# Altium project PCB Version 0.1.PrjPcb
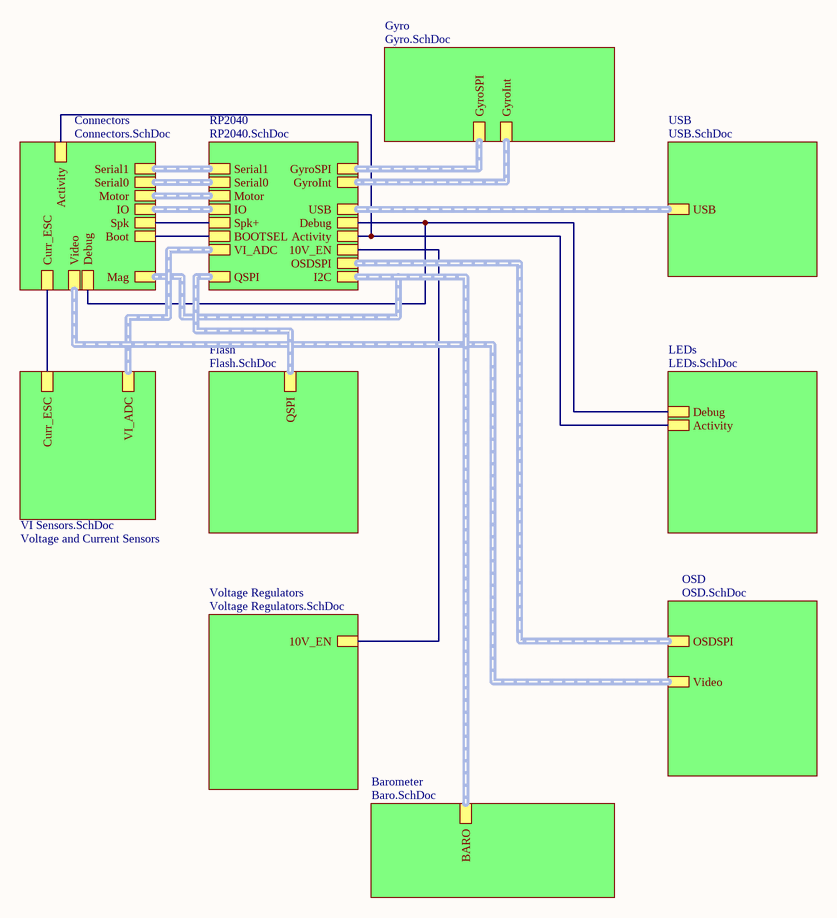
[diagram p0: Main.SchDoc]
5 sheets, 68 parts. Net scope: hierarchical (ports join the sheet entries above them; power ports are global).
Board file: PCB v0.1.PcbDoc
Sheets:
  Main.SchDoc
    Voltage Regulators = Voltage Regulators.SchDoc
    OSD = OSD.SchDoc
    Barometer = Baro.SchDoc
    Voltage and Current Sensors = VI Sensors.SchDoc

## Sheet Main.SchDoc
size A4; SheetNumber: 1; SheetTotal: 11

### Sub-sheets
Barometer = Baro.SchDoc: BARO
Connectors = Connectors.SchDoc (file not in this document): Serial1, Motor, Mag, Serial0, Curr_ESC, IO, Video, Spk, Debug, Activity, Boot
Flash = Flash.SchDoc (file not in this document): QSPI
Gyro = Gyro.SchDoc (file not in this document): GyroSPI, GyroInt
LEDs = LEDs.SchDoc (file not in this document): Debug, Activity
OSD = OSD.SchDoc: OSDSPI, Video
RP2040 = RP2040.SchDoc (file not in this document): QSPI, USB, Debug, Activity, I2C, OSDSPI, GyroSPI, GyroInt, Serial1, Motor, Serial0, VI_ADC, IO, Spk+, 10V_EN, BOOTSEL
USB = USB.SchDoc (file not in this document): USB
Voltage and Current Sensors = VI Sensors.SchDoc: Curr_ESC, VI_ADC
Voltage Regulators = Voltage Regulators.SchDoc: 10V_EN

### Nets
NetIC8_4: sheet Connectors/Curr_ESC, sheet Voltage and Current Sensors/Curr_ESC
NetR35_1: sheet RP2040/10V_EN, sheet Voltage Regulators/10V_EN
(unnamed): sheet RP2040/Debug, sheet LEDs/Debug, sheet Connectors/Debug
(unnamed): sheet RP2040/Activity, sheet LEDs/Activity, sheet Connectors/Activity
(unnamed): sheet RP2040/Spk+, sheet Connectors/Spk
(unnamed): sheet RP2040/BOOTSEL, sheet Connectors/Boot

### Buses and harness runs
harness sheet Barometer/BARO = sheet Connectors/Mag = sheet RP2040/I2C
harness sheet Connectors/IO = sheet RP2040/IO
harness sheet Connectors/Motor = sheet RP2040/Motor
harness sheet Connectors/Serial0 = sheet RP2040/Serial0
harness sheet Connectors/Serial1 = sheet RP2040/Serial1
harness sheet Connectors/Video = sheet OSD/Video
harness sheet Flash/QSPI = sheet RP2040/QSPI
harness sheet Gyro/GyroInt = sheet RP2040/GyroInt
harness sheet Gyro/GyroSPI = sheet RP2040/GyroSPI
harness sheet OSD/OSDSPI = sheet RP2040/OSDSPI
harness sheet RP2040/USB = sheet USB/USB
harness sheet RP2040/VI_ADC = sheet Voltage and Current Sensors/VI_ADC

## Sheet Voltage Regulators.SchDoc
size A4; SheetNumber: 4; SheetTotal: 11
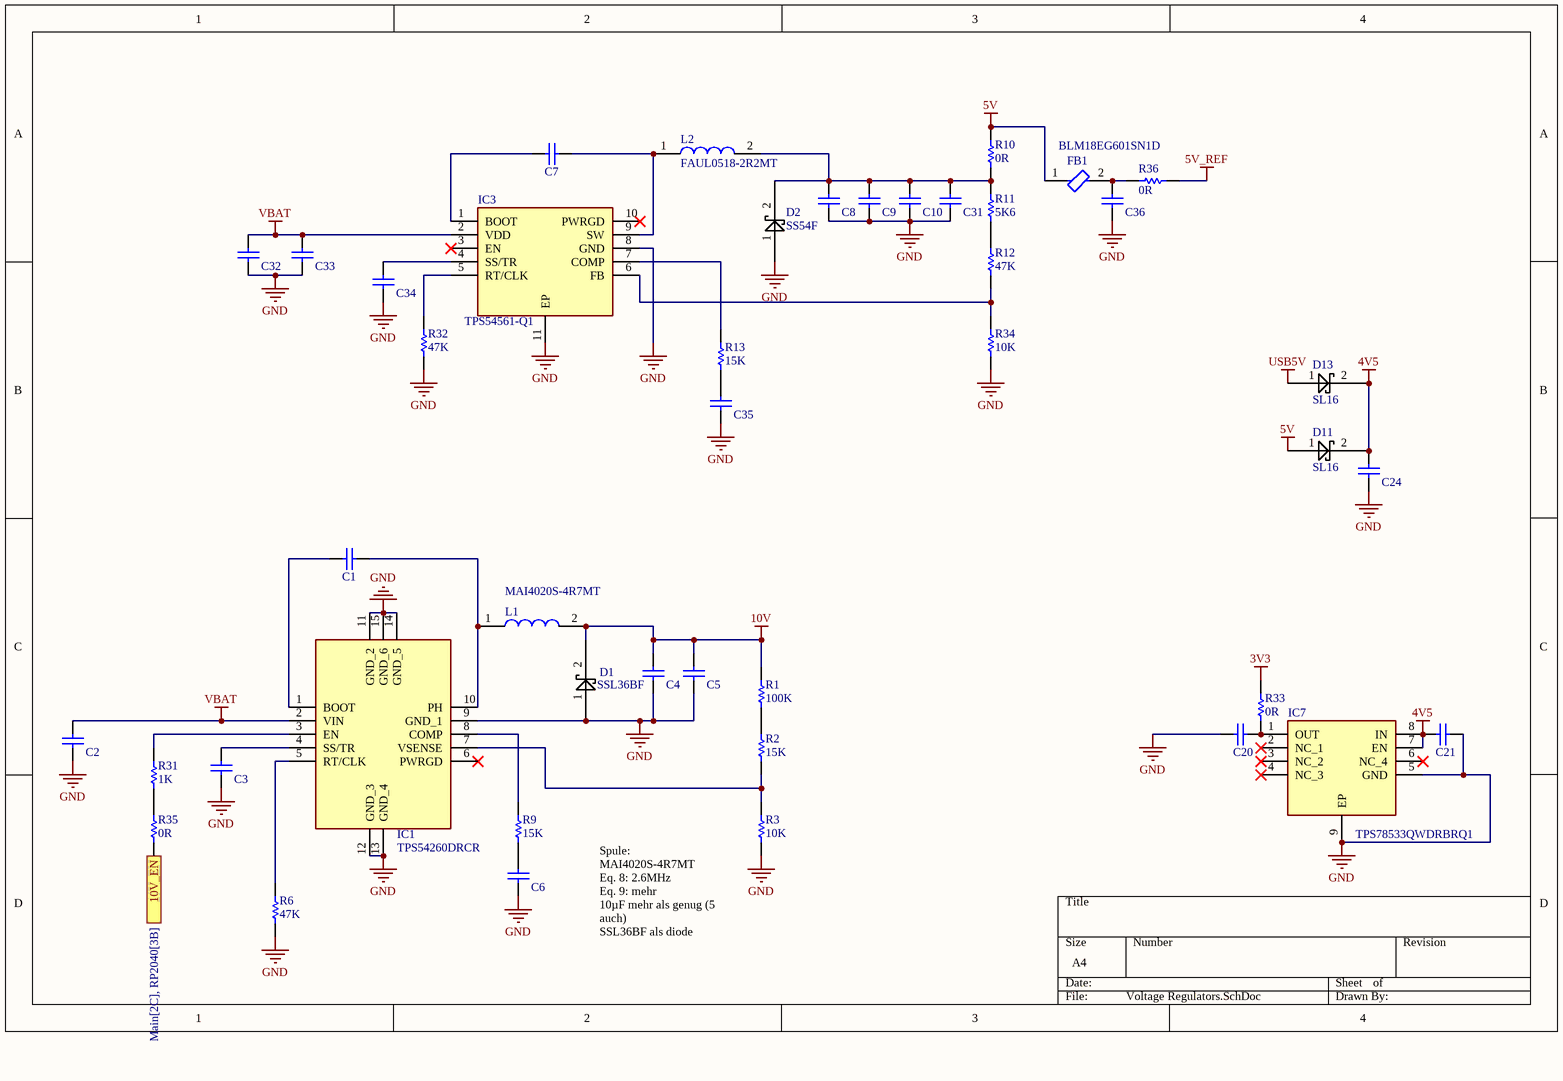
[diagram p1: Voltage Regulators.SchDoc]

### Parts
C1  100nF  [WCAP-CSGP_0603_L1.6W0.8H0.8_Reflow]  (value not drawn)
C2  3.3µF  [WCAP-CSGP_1206_L3.2W1.6H1.6]  (value not drawn)
C3  10nF  [WCAP-CSGP_0603_L1.6W0.8H0.8_Reflow]  (value not drawn)
C4  4.7µF  [WCAP-CSGP_0805_L2W1.25H1.25]  (value not drawn)
C5  4.7µF  [WCAP-CSGP_0805_L2W1.25H1.25]  (value not drawn)
C6  2.5pF  [WCAP-CSGP_0603_L1.6W0.8H0.8_Reflow]  (value not drawn)
C7  100nF  [WCAP-CSGP_0603_L1.6W0.8H0.8_Reflow]  (value not drawn)
C8  4.7µF  [WCAP-CSGP_0805_L2W1.25H1.25]  (value not drawn)
C9  4.7µF  [WCAP-CSGP_0805_L2W1.25H1.25]  (value not drawn)
C10  4.7µF  [WCAP-CSGP_0805_L2W1.25H1.25]  (value not drawn)
C20  1µF  [WCAP-CSGP_0603_L1.6W0.8H0.8_Reflow]  (value not drawn)
C21  1µF  [WCAP-CSGP_0603_L1.6W0.8H0.8_Reflow]  (value not drawn)
C24  1µF  [WCAP-CSGP_0603_L1.6W0.8H0.8_Reflow]  (value not drawn)
C31  4.7µF  [WCAP-CSGP_0805_L2W1.25H1.25]  (value not drawn)
C32  2.2µF  [WCAP-CSGP_0805_L2W1.25H1.25]  (value not drawn)
C33  2.2µF  [WCAP-CSGP_0805_L2W1.25H1.25]  (value not drawn)
C34  10nF  [WCAP-CSGP_0603_L1.6W0.8H0.8_Reflow]  (value not drawn)
C35  1nF  [WCAP-CSGP_0603_L1.6W0.8H0.8_Reflow]  (value not drawn)
C36  1µF  [WCAP-CSGP_0603_L1.6W0.8H0.8_Reflow]  (value not drawn)
D1  SSL36BF  [SSL36BF]
D2  SS54F  [SS54F]
D11  SL16  [SL16]
D13  SL16  [SL16]
FB1  BLM18EG601SN1D  [FP-BLM18-0_15-t0_8-MFG]
IC1  TPS54260DRCR  [TPS54040ADRCT]
IC3  TPS54561-Q1  [SON80P400X400X80-11N]
IC7  TPS78533QWDRBRQ1  [SON65P300X300X100-9N-D]
L1  MAI4020S-4R7MT  [MAI4020S-4R7MT]
L2  FAUL0518-2R2MT  [FAUL0518-2R2MT]
R1  100K  [RESC0603(1608)_N]
R2  15K  [RESC0603(1608)_N]
R3  10K  [RESC0603(1608)_N]
R6  47K  [RESC0603(1608)_N]
R9  15K  [RESC0603(1608)_N]
R10  0R  [RESC0603(1608)_N]
R11  5K6  [RESC0603(1608)_N]
R12  47K  [RESC0603(1608)_N]
R13  15K  [RESC0603(1608)_N]
R31  1K  [RESC0603(1608)_N]
R32  47K  [RESC0603(1608)_N]
R33  0R  [RESC0603(1608)_N]
R34  10K  [RESC0603(1608)_N]
R35  0R  [RESC0603(1608)_N]
R36  0R  [RESC0603(1608)_N]

### Ports
10V_EN (see Main[2C], RP2040[3B])

### Nets
3V3: R33.2
4V5: C21.1 C24.2 D11.2 D13.2 IC7.7(EN) IC7.8(IN)
5V: D11.1 FB1.1 R10.2
5V_REF: R36.2
10V: C4.2 C5.2 D1.2 L1.2 R1.2
GND: C2.1 C3.1 C4.1 C5.1 C6.1 C8.1 C9.1 C10.1 C20.1 C21.2 C24.1 C31.1 C32.1 C33.1 C34.1 C35.1 C36.1 D1.1 D2.1 IC1.9(GND_1) IC1.11(GND_2) IC1.12(GND_3) IC1.13(GND_4) IC1.14(GND_5) IC1.15(GND_6) IC3.8(GND) IC3.11(EP) IC7.5(GND) IC7.9(EP) R3.1 R6.1 R32.1 R34.1
USB5V: D13.1
VBAT: C2.2 C32.2 C33.2 IC1.2(VIN) IC3.2(VDD)
NetC1_1: C1.1 IC1.1(BOOT)
NetC1_2: C1.2 IC1.10(PH) L1.1
NetC3_2: C3.2 IC1.4(SS/TR)
NetC6_2: C6.2 R9.1
NetC7_1: C7.1 IC3.1(BOOT)
NetC7_2: C7.2 IC3.9(SW) L2.1
NetC8_2: C8.2 C9.2 C10.2 C31.2 D2.2 L2.2 R10.1 R11.2
NetC20_2: C20.2 IC7.1(OUT) R33.1
NetC34_2: C34.2 IC3.4(SS/TR)
NetC35_2: C35.2 R13.1
NetC36_2: C36.2 FB1.2 R36.1
NetIC1_3: IC1.3(EN) R31.2
NetIC1_5: IC1.5(RT/CLK) R6.2
NetIC1_7: IC1.7(VSENSE) R2.1 R3.2
NetIC1_8: IC1.8(COMP) R9.2
NetIC3_5: IC3.5(RT/CLK) R32.2
NetIC3_6: IC3.6(FB) R12.1 R34.2
NetIC3_7: IC3.7(COMP) R13.2
NetR1_1: R1.1 R2.2
NetR11_1: R11.1 R12.2
NetR31_1: R31.1 R35.2
NetR35_1: R35.1 ; port 10V_EN

Not connected (* = marked no-connect by the designer): IC1 6(PWRGD)*; IC3 3(EN)* 10(PWRGD)*; IC7 2(NC_1)* 3(NC_2)* 4(NC_3)* 6(NC_4)*

### Notes on the sheet
- (near R3) Spule: MAI4020S-4R7MT
  Eq. 8: 2.6MHz
  Eq. 9: mehr
  10µF mehr als genug (5 auch)
  SSL36BF als diode

### Library data of the parts
C1 C7 = 885012206046: WCAP-CSGP Multilayer Ceramic Chip Capacitor, General Purpose, size 0603, X7R, 100nF, 16VDC; Manufacturer: Wurth Elektronik; Case/Size Code: 0603; Capacitance Tolerance: +/-10%; Dissipation Factor: 3.5%; Insulation Resistance: 5GΩ; Rated Voltage (DC): 16V; Technical Reference: X7R0603104K016DFCT10000; ComponentLink1Description: Website Link; ComponentLink1URL: https://www.we-online.com/redexpert/article/885012206046?ad; ComponentLink2Description: Datasheet Link; ComponentLink2URL: https://www.we-online.com/redexpert/spec/885012206046?ad; Manufacturer Part Number: 885012206046; Category: Multilayer Ceramic Chip Capacitors; Match Code: WCAP-CSGP; Mount: Surface Mount; Operating Temperature Max: 125°C; Operating Temperature Min: -55°C; Packaging: Tape and Reel; Length: 1.6mm; Width: 0.8mm; Height: 0.8mm; Capacitance: 100nF; Ceramic Type: X7R
C2 = 885012208124: TDK C3216X7S2A335KT000N / 3.3µF MLCC 1206 100V X7S; Manufacturer: Wurth Elektronik; Match Code: WCAP-CSGP; Case/Size Code: 1206; Capacitance: 2.2µF; Capacitance Tolerance: +/-10%; Ceramic Type: X7R; Dissipation Factor: 5%; Insulation Resistance: 0.05GΩ; Technical Reference: X7R1206225K100DFCT10000; ComponentLink1Description: Website Link; ComponentLink1URL: https://www.we-online.com/redexpert/article/885012208124?ad; ComponentLink2Description: Datasheet Link; ComponentLink2URL: https://www.we-online.com/redexpert/spec/885012208124?ad; Manufacturer Part Number: 885012208124; Category: Multilayer Ceramic Chip Capacitors; Mount: Surface Mount; Operating Temperature Max: 125°C; Operating Temperature Min: -55°C; Packaging: Tape and Reel; Length: 3.2mm; Width: 1.6mm; Height: 1.6mm; Rated Voltage (DC): 100V
C3 C34 = 885012206040: WCAP-CSGP Multilayer Ceramic Chip Capacitor, General Purpose, size 0603, X7R, 10nF, 16VDC; Manufacturer: Wurth Elektronik; Case/Size Code: 0603; Capacitance Tolerance: +/-10%; Dissipation Factor: 3.5%; Insulation Resistance: 10GΩ; Rated Voltage (DC): 16V; Technical Reference: X7R0603103K016DFCT10000; ComponentLink1Description: Website Link; ComponentLink1URL: https://www.we-online.com/redexpert/article/885012206040?ad; ComponentLink2Description: Datasheet Link; ComponentLink2URL: https://www.we-online.com/redexpert/spec/885012206040?ad; Manufacturer Part Number: 885012206040; Category: Multilayer Ceramic Chip Capacitors; Match Code: WCAP-CSGP; Mount: Surface Mount; Operating Temperature Max: 125°C; Operating Temperature Min: -55°C; Packaging: Tape and Reel; Length: 1.6mm; Width: 0.8mm; Height: 0.8mm; Capacitance: 10nF; Ceramic Type: X7R
C4 C5 C8-C10 C31 = 885012107013: CL21A475KAQNNNG; Manufacturer: Wurth Elektronik; Match Code: WCAP-CSGP; Case/Size Code: 0805; Capacitance Tolerance: +/-20%; Ceramic Type: X5R; Dissipation Factor: 10%; Insulation Resistance: 0.02GΩ; Rated Voltage (DC): 16V; Technical Reference: X5R0805475M016DFCT10000; ComponentLink1Description: Website Link; ComponentLink1URL: https://www.we-online.com/redexpert/article/885012107013?ad; ComponentLink2Description: Datasheet Link; ComponentLink2URL: https://www.we-online.com/redexpert/spec/885012107013?ad; Manufacturer Part Number: 885012107013; Category: Multilayer Ceramic Chip Capacitors; Mount: Surface Mount; Operating Temperature Max: 85°C; Operating Temperature Min: -55°C; Packaging: Tape and Reel; Length: 2mm; Width: 1.25mm; Height: 1.25mm; Capacitance: 4.7µF
C6 C35 = 885012006030: TCC0603COG2R5C500CT; Manufacturer: Wurth Elektronik; Match Code: WCAP-CSGP; Case/Size Code: 0603; Capacitance: 4.7pF; Capacitance Tolerance: +/-0.5pF; Ceramic Type: NP0; Insulation Resistance: 10GΩ; Q Factor: 494; Rated Voltage (DC): 25V; Technical Reference: NP006034R7D025DFCT10000; ComponentLink1Description: Website Link; ComponentLink1URL: https://www.we-online.com/redexpert/article/885012006030?ad; ComponentLink2Description: Datasheet Link; ComponentLink2URL: https://www.we-online.com/redexpert/spec/885012006030?ad; Manufacturer Part Number: 885012006030; Category: Multilayer Ceramic Chip Capacitors; Mount: Surface Mount; Operating Temperature Max: 125°C; Operating Temperature Min: -55°C; Packaging: Tape and Reel; Length: 1.6mm; Width: 0.8mm; Height: 0.8mm
C20 C21 C36 = 885012206026: WCAP-CSGP Multilayer Ceramic Chip Capacitor, General Purpose, size 0603, X7R, 1µF, 10VDC; Manufacturer: Wurth Elektronik; Case/Size Code: 0603; Capacitance Tolerance: +/-10%; Dissipation Factor: 10%; Insulation Resistance: 0.1GΩ; Rated Voltage (DC): 10V; Technical Reference: X7R0603105K010DFCT10000; ComponentLink1Description: Website Link; ComponentLink1URL: https://www.we-online.com/redexpert/article/885012206026?ad; ComponentLink2Description: Datasheet Link; ComponentLink2URL: https://www.we-online.com/redexpert/spec/885012206026?ad; Manufacturer Part Number: 885012206026; Category: Multilayer Ceramic Chip Capacitors; Match Code: WCAP-CSGP; Mount: Surface Mount; Operating Temperature Max: 125°C; Operating Temperature Min: -55°C; Packaging: Tape and Reel; Length: 1.6mm; Width: 0.8mm; Height: 0.8mm; Capacitance: 1µF; Ceramic Type: X7R
C24 = 885012106017: WCAP-CSGP Multilayer Ceramic Chip Capacitor, General Purpose, size 0603, X5R, 1µF, 16VDC; Manufacturer: Wurth Elektronik; Case/Size Code: 0603; Capacitance Tolerance: +/-20%; Dissipation Factor: 10%; Insulation Resistance: 0.1GΩ; Rated Voltage (DC): 16V; Technical Reference: X5R0603105M016DFCT10000; ComponentLink1Description: Website Link; ComponentLink1URL: https://www.we-online.com/redexpert/article/885012106017?ad; ComponentLink2Description: Datasheet Link; ComponentLink2URL: https://www.we-online.com/redexpert/spec/885012106017?ad; Manufacturer Part Number: 885012106017; Category: Multilayer Ceramic Chip Capacitors; Match Code: WCAP-CSGP; Mount: Surface Mount; Operating Temperature Max: 85°C; Operating Temperature Min: -55°C; Packaging: Tape and Reel; Length: 1.6mm; Width: 0.8mm; Height: 0.8mm; Capacitance: 1µF; Ceramic Type: X5R
C32 C33 = 885012107013: CL21B225KBYNNNE; Manufacturer: Wurth Elektronik; Match Code: WCAP-CSGP; Case/Size Code: 0805; Capacitance: 4.7µF; Capacitance Tolerance: +/-20%; Ceramic Type: X5R; Dissipation Factor: 10%; Insulation Resistance: 0.02GΩ; Rated Voltage (DC): 16V; Technical Reference: X5R0805475M016DFCT10000; ComponentLink1Description: Website Link; ComponentLink1URL: https://www.we-online.com/redexpert/article/885012107013?ad; ComponentLink2Description: Datasheet Link; ComponentLink2URL: https://www.we-online.com/redexpert/spec/885012107013?ad; Manufacturer Part Number: 885012107013; Category: Multilayer Ceramic Chip Capacitors; Mount: Surface Mount; Operating Temperature Max: 85°C; Operating Temperature Min: -55°C; Packaging: Tape and Reel; Length: 2mm; Width: 1.25mm; Height: 1.25mm
FB1 = CMP-0686-00354-3: Chip Ferrite Bead, 0603, 600Ω @ 100MHz, 0.35Ω, 25%, 500mA; Manufacturer Series: BLM18E; Number of Lines: 1; DC Resistance (DCR): 350mR; Impedance: 600R; Material: Steel; Shielding: Unshielded; Package Quantity: 1; Case/Package: 0603; Length: 1.6mm; Packaging: Tape and Reel; Resistance: 350mR; REACH SVHC: No SVHC; Military Standard: Not; Contact Plating: Tin; Termination: SMD/SMT; Number of Circuits: 1; Width: 0.8mm; Test Frequency: 100MHz; DC Current: 500mA; Case Code (Metric): 1608; Max DC Current: 500mA; Max Operating Temperature: 125°C; Current Rating: 500mA; Series: BLM18E; Tolerance: 25%; Min Operating Temperature: -55°C; Frequency: 100MHz; Lead Free: Lead Free; Terminal Finish: Tin; Number of Pins: 2; Max Current Rating: 500mA; Radiation Hardening: No; Case Code (Imperial): 0603; Number of Functions: 1; Depth: 0.8mm; DC Resistance-Max: 350mR; Height: 0.8mm; Core Material: Ferrite; RoHS Compliant: Yes
IC1 = TPS54260DRCR: Integrated Circuit; Manufacturer_Name: Texas Instruments; Datasheet Link: http://www.ti.com/lit/gpn/TPS54040A; Height: 1mm; Manufacturer_Part_Number: TPS54260DRCR; Mouser Part Number: 595-TPS54260DRCR; Mouser Price/Stock: https://www.mouser.co.uk/ProductDetail/Texas-Instruments/TPS54260DRCR?qs=O1HRStiETChM7xK%2FSiuP6w%3D%3D; Arrow Part Number: TPS54260DRCR; Arrow Price/Stock: https://www.arrow.com/en/products/tps54260drcr/texas-instruments?region=nac
IC3 = TPS54561-Q1: Integrated Circuit; Manufacturer_Name: Texas Instruments; Datasheet Link: http://www.ti.com/lit/gpn/tps54561-q1; Height: 0.8mm; Manufacturer_Part_Number: TPS54561-Q1
IC7 = TPS78533QWDRBRQ1: Integrated Circuit; Manufacturer_Name: Texas Instruments; Datasheet Link: https://www.arrow.com/en/products/tps78533qwdrbrq1/texas-instruments?region=nac; Height: 1mm; Manufacturer_Part_Number: TPS78533QWDRBRQ1; Mouser Part Number: 595-TPS78533QWDRBRQ1; Mouser Price/Stock: https://www.mouser.co.uk/ProductDetail/Texas-Instruments/TPS78533QWDRBRQ1?qs=iLbezkQI%252BsiNbdqh2Ko9GQ%3D%3D; Arrow Part Number: TPS78533QWDRBRQ1; Arrow Price/Stock: https://www.arrow.com/en/products/tps78533qwdrbrq1/texas-instruments?region=nac
R1 = Res 100K: Chipwiderstand, SMD, Baureihe MC, 1%; Manufacturer: Multicomp; PackageReference: 0603; Value: 100K; OC_FARNELL: 9330402
R2 R9 R12 R13 = Res 12K: Chipwiderstand, SMD, Baureihe MC, 1%; Manufacturer: Multicomp; Value: 12K; PackageReference: 0603; OC_FARNELL: 9330518
R3 R34 = Res 10K: Chipwiderstand, SMD, Baureihe MC, 1%; Manufacturer: Multicomp; PackageReference: 0603; Value: 10K; OC_FARNELL: 9330399
R6 R32 = Res 47R: Chipwiderstand, SMD, Baureihe MC, 1%; Manufacturer: Multicomp; Value: 47R; PackageReference: 0603; OC_FARNELL: 1576259
R10 R33 R35 R36 = Res 0R: Chipwiderstand, SMD, Baureihe MC, 1%; Manufacturer: Multicomp; PackageReference: 0603; Value: 0R; OC_FARNELL: 9331662
R11 = Res 100K: Chipwiderstand, SMD, Baureihe MC, 1%; Manufacturer: Multicomp; Value: 100K; PackageReference: 0603; OC_FARNELL: 9330402
R31 = Res 1K: Chipwiderstand, SMD, Baureihe MC, 1%; Manufacturer: Multicomp; PackageReference: 0603; Value: 1K; OC_FARNELL: 9330380

## Sheet OSD.SchDoc
size A4; SheetNumber: 7; SheetTotal: 11
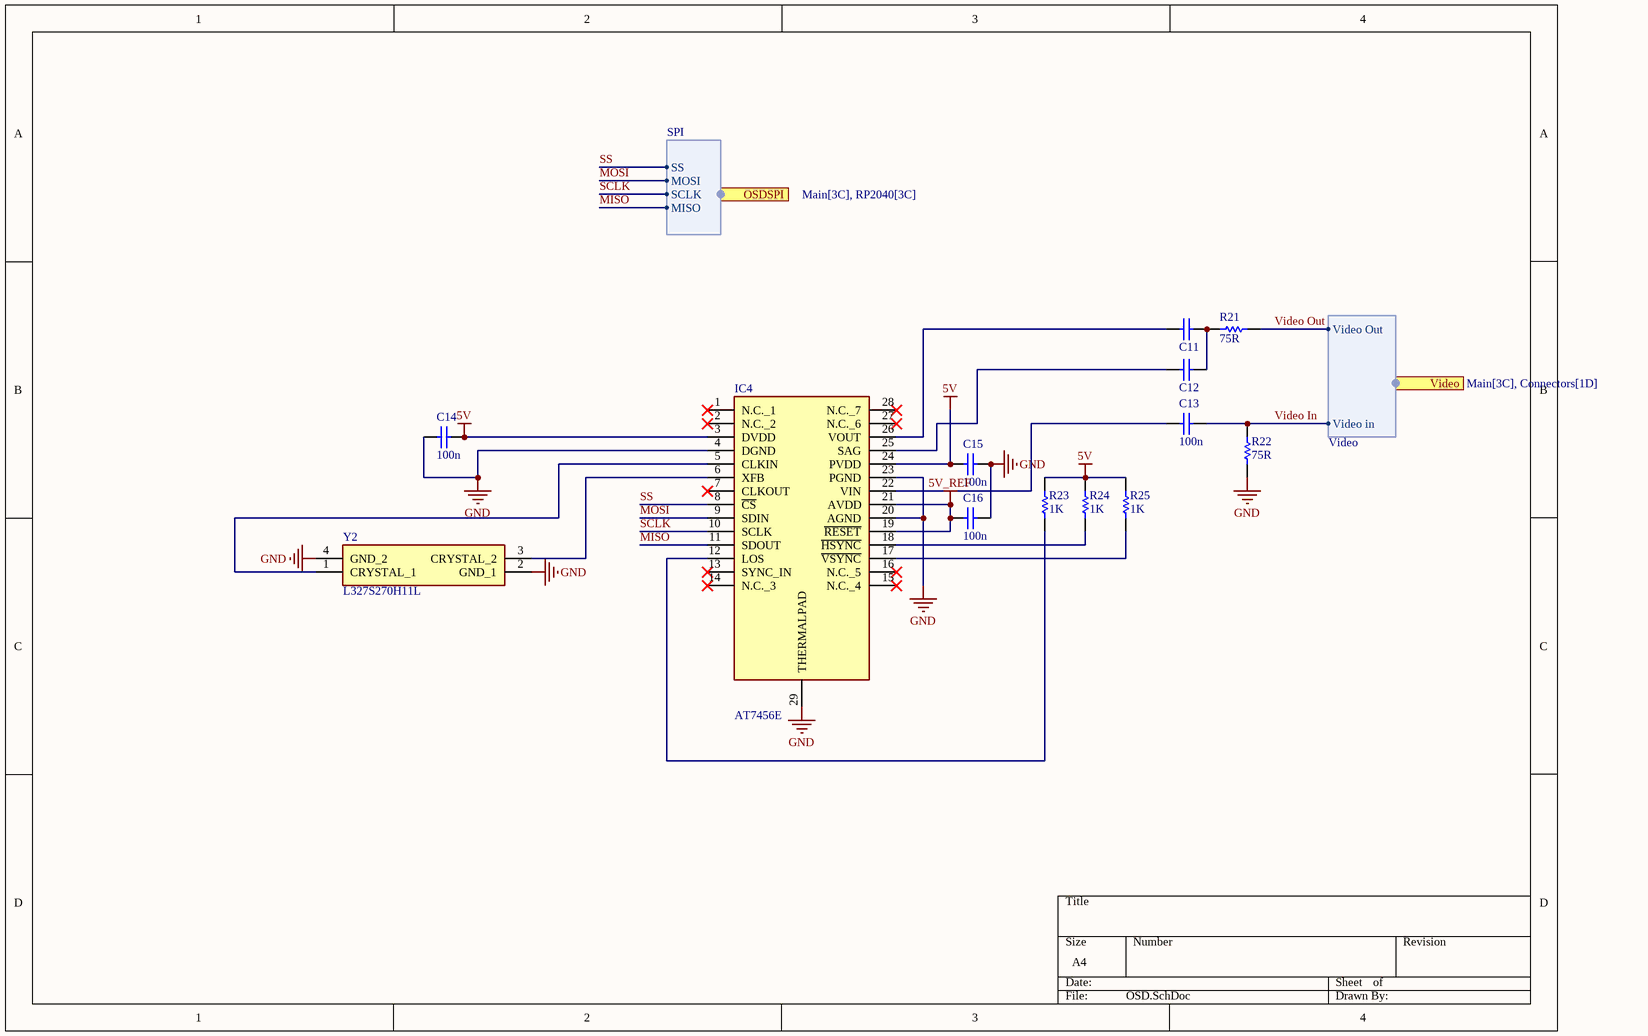
[diagram p2: OSD.SchDoc]

### Parts
C11  10µF  [WCAP-CSGP_0603_L1.6W0.8H0.8_Reflow]  (value not drawn)
C12  10µF  [WCAP-CSGP_0603_L1.6W0.8H0.8_Reflow]  (value not drawn)
C13  100n  [CAPC0603(1608)55_N]
C14  100n  [CAPC0603(1608)55_N]
C15  100n  [CAPC0603(1608)55_N]
C16  100n  [CAPC0603(1608)55_N]
IC4  AT7456E  [SOP65P640X120-29N]
R21  75R  [RESC0603(1608)_N]
R22  75R  [RESC0603(1608)_N]
R23  1K  [RESC0603(1608)_N]
R24  1K  [RESC0603(1608)_N]
R25  1K  [RESC0603(1608)_N]
Y2  L327S270H11L  [SMD3225_4P12288MHZ12PF10PPM4085]

### Ports
OSDSPI (harness SPI, see Main[3C], RP2040[3C]), Video (harness Video, see Main[3C], Connectors[1D])

### Harnesses
SPI: SS, MOSI, SCLK, MISO
Video: Video Out, Video in

### Nets
5V: C14.2 C15.1 IC4.3(DVDD) IC4.24(PVDD) R23.2 R24.2 R25.2
5V_REF: C16.1 IC4.19(~{RESET}) IC4.21(AVDD)
GND: C14.1 C15.2 C16.2 IC4.4(DGND) IC4.20(AGND) IC4.23(PGND) IC4.29(THERMALPAD) R22.1 Y2.2(GND_1) Y2.4(GND_2)
MISO: IC4.11(SDOUT) ; port OSDSPI.MISO
MOSI: IC4.9(SDIN) ; port OSDSPI.MOSI
SCLK: IC4.10(SCLK) ; port OSDSPI.SCLK
SS: IC4.8(~{CS}) ; port OSDSPI.SS
Video In: C13.2 R22.2 ; port Video.Video in
Video Out: R21.1 ; port Video.Video Out
NetC11_1: C11.1 IC4.26(VOUT)
NetC11_2: C11.2 C12.2 R21.2
NetC12_1: C12.1 IC4.25(SAG)
NetC13_1: C13.1 IC4.22(VIN)
NetIC4_5: IC4.5(CLKIN) Y2.1(CRYSTAL_1)
NetIC4_6: IC4.6(XFB) Y2.3(CRYSTAL_2)
NetIC4_12: IC4.12(LOS) R23.1
NetIC4_17: IC4.17(~{VSYNC}) R25.1
NetIC4_18: IC4.18(~{HSYNC}) R24.1

Not connected (* = marked no-connect by the designer): IC4 1(N.C._1)* 2(N.C._2)* 7(CLKOUT)* 13(SYNC_IN)* 14(N.C._3)* 15(N.C._4)* 16(N.C._5)* 27(N.C._6)* 28(N.C._7)*

### Library data of the parts
C11 C12 = 885012106031: WCAP-CSGP Multilayer Ceramic Chip Capacitor, General Purpose, size 0603, X5R, 10µF, 25VDC; Manufacturer: Wurth Elektronik; Case/Size Code: 0603; Capacitance Tolerance: +/20%; Dissipation Factor: 20%; Insulation Resistance: 0.01GΩ; Rated Voltage (DC): 25V; Technical Reference: X5R0603106M025DFCT10000; ComponentLink1Description: Website Link; ComponentLink1URL: https://www.we-online.com/redexpert/article/885012106031?ad; ComponentLink2Description: Datasheet Link; ComponentLink2URL: https://www.we-online.com/redexpert/spec/885012106031?ad; Manufacturer Part Number: 885012106031; Category: Multilayer Ceramic Chip Capacitors; Match Code: WCAP-CSGP; Mount: Surface Mount; Operating Temperature Max: 85°C; Operating Temperature Min: -55°C; Packaging: Tape and Reel; Length: 1.6mm; Width: 0.8mm; Height: 0.8mm; Capacitance: 10µF; Ceramic Type: X5R
C13-C16 = Cap 100n: Keramikvielschichtkondensator, SMD, Baureihe MC, ± 20%; Manufacturer: Multicomp; OC_FARNELL: 1759038; Value: 100n; PackageReference: 0603
IC4 = AT7456E: Integrated Circuit; Manufacturer_Name: ICOF; Datasheet Link: https://datasheet.lcsc.com/szlcsc/ZHONGKEWEI-AT7456E_C82351.pdf; Height: 1.2mm; Manufacturer_Part_Number: AT7456E
R21 R22 = Res 750R: Chipwiderstand, SMD, Baureihe MC, 1%; Manufacturer: Multicomp; Value: 750R; PackageReference: 0603; OC_FARNELL: 9331506
R23-R25 = Res 1K: as R31 on sheet Voltage Regulators; PackageReference: 0603; Value: 1K; OC_FARNELL: 9330380
Y2 = SMD-3225_4P_12.288MHZ_12PF_10PPM_-40~+85: Crystal or Oscillator; Manufacturer_Name: TAE(Zhejiang Abel Elec); Manufacturer_Part_Number: SMD-3225_4P 12.288MHZ 12PF 10PPM -40~+85¡æ; Datasheet Link: https://datasheet.lcsc.com/szlcsc/1901241506_Zhejiang-Abel-Elec-SMD-3225-4P-12-288MHZ-12PF-10PPM-40-85_C362472.pdf; Height: 0.8mm

## Sheet Baro.SchDoc
size A4; SheetNumber: 8; SheetTotal: 11
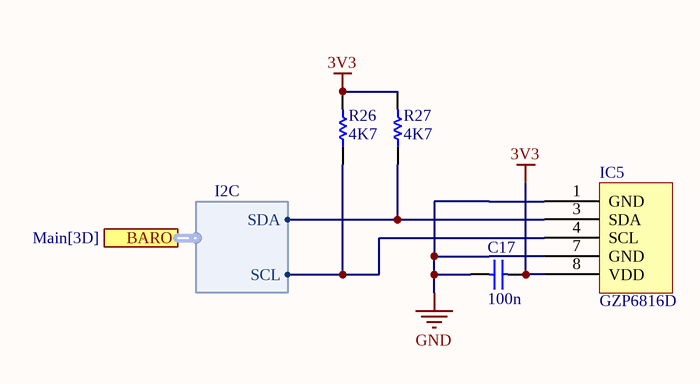
[diagram p3: Baro.SchDoc]

### Parts
C17  100n  [CAPC0603(1608)55_N]
IC5  GZP6816D  [GZP6816D]
R26  4K7  [RESC0603(1608)_N]
R27  4K7  [RESC0603(1608)_N]

### Ports
BARO (harness I2C, see Main[3D])

### Harnesses
I2C: SDA, SCL

### Nets
3V3: C17.1 IC5.8(VDD) R26.2 R27.2
GND: C17.2 IC5.1(GND) IC5.7(GND)
NetIC5_3: IC5.3(SDA) R27.1 ; port BARO.SDA
NetIC5_4: IC5.4(SCL) R26.1 ; port BARO.SCL

### Library data of the parts
C17 = Cap 100n: as C13 on sheet OSD; OC_FARNELL: 1759038; Value: 100n; PackageReference: 0603
R26 R27 = Res 4k7: Chipwiderstand, SMD, Baureihe MC, 5%; Manufacturer: Multicomp; PackageReference: 0603; Value: 4K7; OC_FARNELL: 9332154

## Sheet VI Sensors.SchDoc
size A4; SheetNumber: 11; SheetTotal: 11
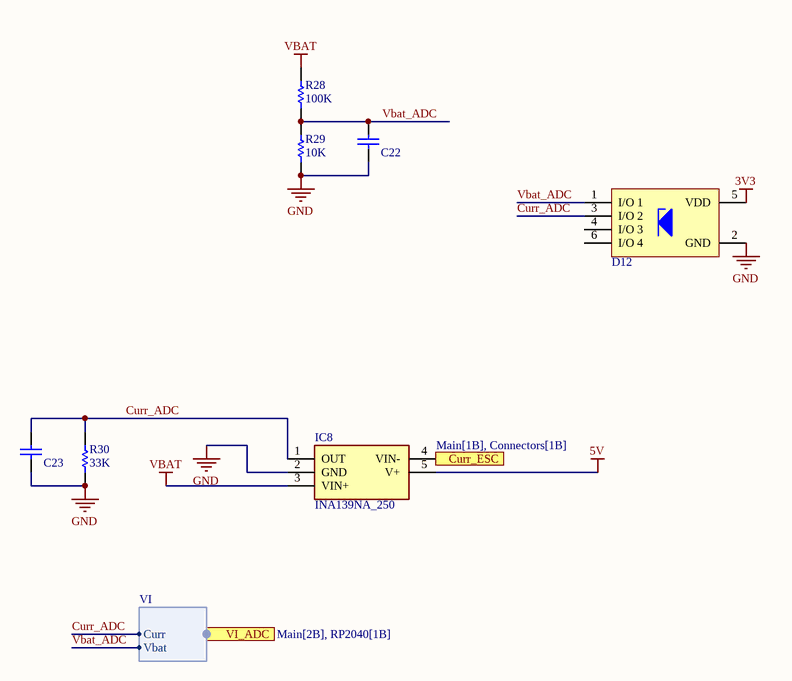
[diagram p4: VI Sensors.SchDoc]

### Parts
C22  1µF  [WCAP-CSGP_0603_L1.6W0.8H0.8_Reflow]  (value not drawn)
C23  1µF  [WCAP-CSGP_0603_L1.6W0.8H0.8_Reflow]  (value not drawn)
D12  3.3V  [WE-TVS_SOT23-6L]  (value not drawn)
IC8  INA139NA_250  [SOT95P280X145-5N]
R28  100K  [RESC0603(1608)_N]
R29  10K  [RESC0603(1608)_N]
R30  33K  [RESC0603(1608)_N]

### Ports
Curr_ESC (see Main[1B], Connectors[1B]), VI_ADC (harness VI, see Main[2B], RP2040[1B])

### Harnesses
VI: Curr, Vbat

### Nets
3V3: D12.5(VDD)
5V: IC8.5(V+)
GND: C22.1 C23.1 D12.2(GND) IC8.2(GND) R29.1 R30.1
VBAT: IC8.3(VIN+) R28.2
Curr_ADC: C23.2 D12.3(I/O_2) IC8.1(OUT) R30.2 ; port VI_ADC.Curr
Vbat_ADC: C22.2 D12.1(I/O_1) R28.1 R29.2 ; port VI_ADC.Vbat
NetIC8_4: IC8.4(VIN-) ; port Curr_ESC

Not connected (* = marked no-connect by the designer): D12 4(I/O_3) 6(I/O_4)

### Library data of the parts
C22 C23 = 885012106017: as C24 on sheet Voltage Regulators; ComponentLink1Description: Website Link; ComponentLink1URL: https://www.we-online.com/redexpert/article/885012106017?ad; ComponentLink2Description: Datasheet Link; ComponentLink2URL: https://www.we-online.com/redexpert/spec/885012106017?ad; Manufacturer Part Number: 885012106017; Category: Multilayer Ceramic Chip Capacitors; Match Code: WCAP-CSGP; Mount: Surface Mount; Operating Temperature Max: 85°C; Operating Temperature Min: -55°C; Packaging: Tape and Reel; Length: 1.6mm; Width: 0.8mm; Height: 0.8mm; Capacitance: 1µF; Ceramic Type: X5R
D12 = 824015043: Shenzhen JingYang TT0514VL; Manufacturer: Wurth Elektronik; Match Code: WE-TVS; Case/Size Code: SOT23-6L; Channel ESD Clamping Voltage: 7.5V; Channel Input Capacitance: 2pF; Channel Reverse Leakage Current: 1µA; ESD Air Discharge Capability: 30kV; Number of Channels: 4+1; Polarity: Unidirectional; (Reverse) Breakdown Voltage: 4.5V; (Reverse) Peak Pulse Current: 30A; ComponentLink1Description: Website Link; ComponentLink1URL: https://www.we-online.com/redexpert/article/824015043?ad; ComponentLink2Description: Datasheet Link; ComponentLink2URL: https://www.we-online.com/redexpert/spec/824015043?ad; Manufacturer Part Number: 824015043; Category: ESD Protection; Mount: Surface Mount; Operating Temperature Max: 125°C; Operating Temperature Min: -55°C; Packaging: Tape and Reel; Length: 2.9mm; Width: 2.8mm; Height: 1.45mm; Channel Operating Voltage: 3.3V; ESD Contact Discharge Capability: 30kV
IC8 = INA139NA_250: Integrated Circuit; Manufacturer_Name: Texas Instruments; Manufacturer_Part_Number: INA139NA/250; Datasheet Link: http://www.ti.com/lit/ds/symlink/ina139.pdf; Height: 1.45mm; Mouser Part Number: 595-INA139NA/250; Mouser Price/Stock: https://www.mouser.co.uk/ProductDetail/Texas-Instruments/INA139NA-250?qs=VBduBm9rCJQSYOixXF05Zw%3D%3D; Arrow Part Number: INA139NA/250; Arrow Price/Stock: https://www.arrow.com/en/products/ina139na250/texas-instruments?region=nac
R28 = Res 100K: as R1 on sheet Voltage Regulators; PackageReference: 0603; Value: 100K; OC_FARNELL: 9330402
R29 = Res 10K: as R3 on sheet Voltage Regulators; PackageReference: 0603; Value: 10K; OC_FARNELL: 9330399
R30 = Res 33K: Chipwiderstand, SMD, Baureihe MC, 1%; Manufacturer: Multicomp; Value: 750R; PackageReference: 0603; OC_FARNELL: 9331506

## Nets that join several sheets
3V3: Voltage Regulators (R33.2), Baro (C17.1 IC5.8 R26.2 R27.2), VI Sensors (D12.5)
5V: Voltage Regulators (D11.1 FB1.1 R10.2), OSD (7 pins), VI Sensors (IC8.5)
5V_REF: Voltage Regulators (R36.2), OSD (C16.1 IC4.19 IC4.21)
GND: Voltage Regulators (33 pins), OSD (10 pins), Baro (C17.2 IC5.1 IC5.7), VI Sensors (6 pins)
VBAT: Voltage Regulators (5 pins), VI Sensors (IC8.3 R28.2)